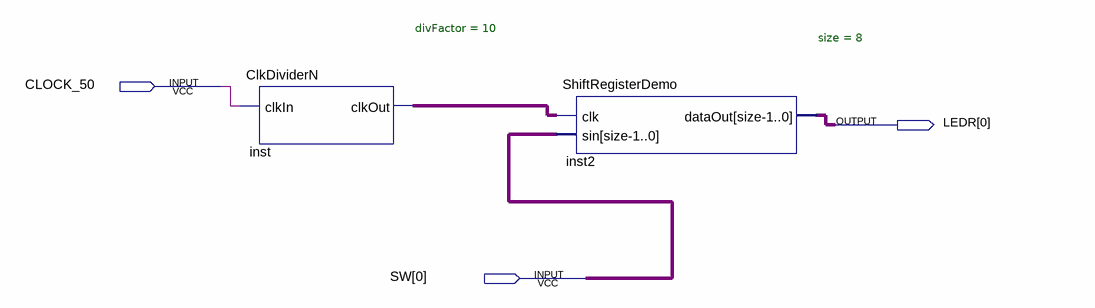
[diagram p0: schematic sheet]
// Quartus schematic ShiftRegister_Demo.bdf as structural Verilog: 2 symbols, 3 pins
module ShiftRegister_Demo (
  input  CLOCK_50,
  input  [0:0] SW,
  output [0:0] LEDR
);

  wire inst_clkout;
  wire [7:0] inst2_dataout, undriven;

  ClkDividerN #(.divFactor(10)) inst (.clkIn(CLOCK_50), .clkOut(inst_clkout));
  ShiftRegisterDemo #(.size(8)) inst2 (.clk(inst_clkout), .sin(undriven), .dataOut(inst2_dataout));
endmodule
